# Altium project IRsensor_Relayx4_Controller.PrjPcb
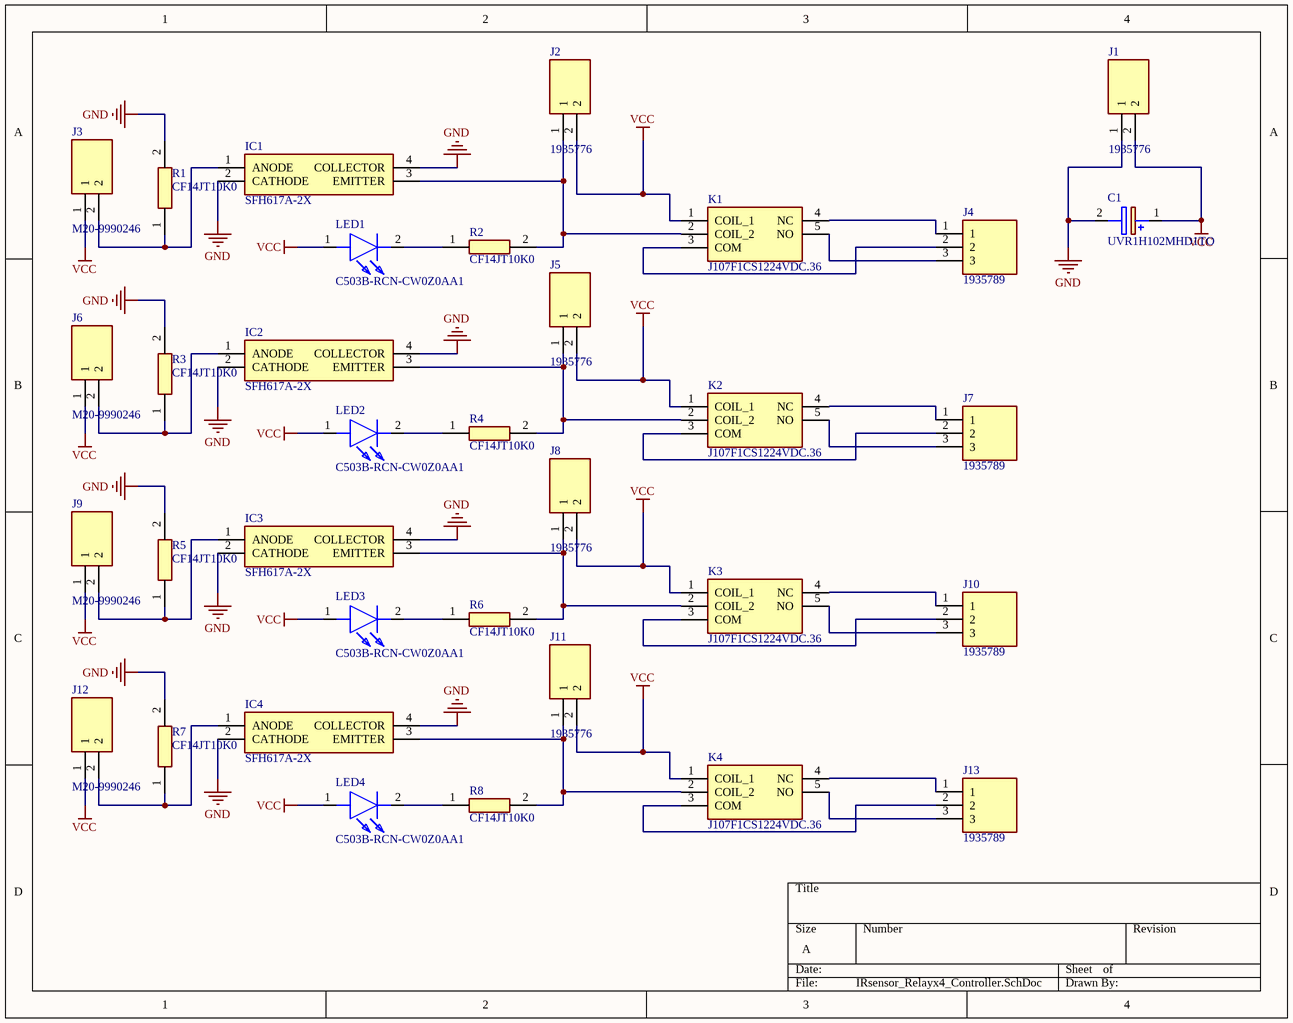
[diagram p0: IRsensor_Relayx4_Controller.SchDoc]
1 sheet, 34 parts. Net scope: global (net labels, ports and power ports of the same name join across sheets).
Board file: IRsensor_Relayx4_Controller.PcbDoc

## Sheet IRsensor_Relayx4_Controller.SchDoc
size A; SheetNumber: 1; SheetTotal: 1

### Parts
C1  UVR1H102MHD1TO  [CAPPRD500W60D1275H2700]
IC1  SFH617A-2X  [DIP762W50P254L458H400Q4N]
IC2  SFH617A-2X  [DIP762W50P254L458H400Q4N]
IC3  SFH617A-2X  [DIP762W50P254L458H400Q4N]
IC4  SFH617A-2X  [DIP762W50P254L458H400Q4N]
J1  1935776  [1935776]
J2  1935776  [1935776]
J3  M20-9990246  [HDRV2W66P0X254_1X2_508X254X874P]
J4  1935789  [1935789]
J5  1935776  [1935776]
J6  M20-9990246  [HDRV2W66P0X254_1X2_508X254X874P]
J7  1935789  [1935789]
J8  1935776  [1935776]
J9  M20-9990246  [HDRV2W66P0X254_1X2_508X254X874P]
J10  1935789  [1935789]
J11  1935776  [1935776]
J12  M20-9990246  [HDRV2W66P0X254_1X2_508X254X874P]
J13  1935789  [1935789]
K1  J107F1CS1224VDC.36  [J107F1CS1224VDC36]
K2  J107F1CS1224VDC.36  [J107F1CS1224VDC36]
K3  J107F1CS1224VDC.36  [J107F1CS1224VDC36]
K4  J107F1CS1224VDC.36  [J107F1CS1224VDC36]
LED1  C503B-RCN-CW0Z0AA1  [C503BRCNCW0Z0AA1]
LED2  C503B-RCN-CW0Z0AA1  [C503BRCNCW0Z0AA1]
LED3  C503B-RCN-CW0Z0AA1  [C503BRCNCW0Z0AA1]
LED4  C503B-RCN-CW0Z0AA1  [C503BRCNCW0Z0AA1]
R1  CF14JT10K0  [RESAD1520W63L600D230]
R2  CF14JT10K0  [RESAD1520W63L600D230]
R3  CF14JT10K0  [RESAD1520W63L600D230]
R4  CF14JT10K0  [RESAD1520W63L600D230]
R5  CF14JT10K0  [RESAD1520W63L600D230]
R6  CF14JT10K0  [RESAD1520W63L600D230]
R7  CF14JT10K0  [RESAD1520W63L600D230]
R8  CF14JT10K0  [RESAD1520W63L600D230]

### Nets
GND: C1.2(-) IC1.2(CATHODE) IC1.4(COLLECTOR) IC2.2(CATHODE) IC2.4(COLLECTOR) IC3.2(CATHODE) IC3.4(COLLECTOR) IC4.2(CATHODE) IC4.4(COLLECTOR) J1.1 R1.2 R3.2 R5.2 R7.2
VCC: C1.1(+) J1.2 J2.2 J3.1 J5.2 J6.1 J8.2 J9.1 J11.2 J12.1 K1.1(COIL_1) K2.1(COIL_1) K3.1(COIL_1) K4.1(COIL_1) LED1.1(A) LED2.1(A) LED3.1(A) LED4.1(A)
NetIC1_1: IC1.1(ANODE) J3.2 R1.1
NetIC1_3: IC1.3(EMITTER) J2.1 K1.2(COIL_2) R2.2
NetIC2_1: IC2.1(ANODE) J6.2 R3.1
NetIC2_3: IC2.3(EMITTER) J5.1 K2.2(COIL_2) R4.2
NetIC3_1: IC3.1(ANODE) J9.2 R5.1
NetIC3_3: IC3.3(EMITTER) J8.1 K3.2(COIL_2) R6.2
NetIC4_1: IC4.1(ANODE) J12.2 R7.1
NetIC4_3: IC4.3(EMITTER) J11.1 K4.2(COIL_2) R8.2
NetJ4_1: J4.1 K1.4(NC)
NetJ4_2: J4.2 K1.3(COM)
NetJ4_3: J4.3 K1.5(NO)
NetJ7_1: J7.1 K2.4(NC)
NetJ7_2: J7.2 K2.3(COM)
NetJ7_3: J7.3 K2.5(NO)
NetJ10_1: J10.1 K3.4(NC)
NetJ10_2: J10.2 K3.3(COM)
NetJ10_3: J10.3 K3.5(NO)
NetJ13_1: J13.1 K4.4(NC)
NetJ13_2: J13.2 K4.3(COM)
NetJ13_3: J13.3 K4.5(NO)
NetLED1_2: LED1.2(K) R2.1
NetLED2_2: LED2.2(K) R4.1
NetLED3_2: LED3.2(K) R6.1
NetLED4_2: LED4.2(K) R8.1

### Library data of the parts
C1 = UVR1H102MHD1TO: Capacitor Polarised; Manufacturer_Name: Nichicon; Datasheet Link: http://nichicon-us.com/english/products/pdfs/e-uvr.pdf; Height: 27mm; Manufacturer_Part_Number: UVR1H102MHD1TO; Mouser Part Number: 647-UVR1H102MHD1T0; Mouser Price/Stock: https://www.mouser.co.uk/ProductDetail/Nichicon/UVR1H102MHD1TO?qs=Wu4QelNNmeNg4t%252BBksLOmQ%3D%3D; Arrow Part Number: UVR1H102MHD1TO; Arrow Price/Stock: https://www.arrow.com/en/products/uvr1h102mhd1to/nichicon
IC1-IC4 = SFH617A-2X: Integrated Circuit; Manufacturer_Name: Isocom; Datasheet Link: http://www.farnell.com/datasheets/91023.pdf?_ga=2.50651689.1688980470.1514904698-1411154270.1472651675; Height: 4mm; Manufacturer_Part_Number: SFH617A-2X
J1 J2 J5 J8 J11 = 1935776: Connector; Manufacturer_Name: Phoenix Contact; Datasheet Link: https://datasheet.datasheetarchive.com/originals/distributors/Datasheets-DGA18/1075322.pdf; Height: 13.5mm; Manufacturer_Part_Number: 1935776; Mouser Part Number: 651-1935776; Mouser Price/Stock: https://www.mouser.co.uk/ProductDetail/Phoenix-Contact/1935776?qs=gjk32EaArKJ3oesOAo3TWA%3D%3D; Arrow Part Number: 1935776; Arrow Price/Stock: https://www.arrow.com/en/products/1935776/phoenix-contact?region=nac
J3 J6 J9 J12 = M20-9990246: Connector; Manufacturer_Name: Harwin; Datasheet Link: https://cdn.harwin.com/pdfs/M20-999.pdf; Height: 8.74mm; Manufacturer_Part_Number: M20-9990246; Mouser Part Number: 855-M20-9990246; Mouser Price/Stock: https://www.mouser.co.uk/ProductDetail/Harwin/M20-9990246?qs=Jph8NoUxIfWjw4WmyRvzag%3D%3D
J4 J7 J10 J13 = 1935789: Connector; Manufacturer_Name: Phoenix Contact; Datasheet Link: https://www.phoenixcontact.com/online/portal/us?uri=pxc-oc-itemdetail:pid=1935789&library=usen&tab=1; Height: 13.65mm; Manufacturer_Part_Number: 1935789; Mouser Part Number: 651-1935789; Mouser Price/Stock: https://www.mouser.co.uk/ProductDetail/Phoenix-Contact/1935789?qs=Acf35Ay%2FzLfkp38c%252B1VczQ%3D%3D; Arrow Part Number: 1935789; Arrow Price/Stock: https://www.arrow.com/en/products/1935789/phoenix-contact?region=nac
K1-K4 = J107F1CS1224VDC.36: Relay or Contactor; Manufacturer_Name: CIT; Datasheet Link: https://www.citrelay.com/Catalog%20Pages/RelayCatalog/J107F.pdf; Height: 15.29mm; Manufacturer_Part_Number: J107F1CS1224VDC.36
LED1-LED4 = C503B-RCN-CW0Z0AA1: LED; Manufacturer_Name: Cree; Datasheet Link: https://www.cree.com/led-components/media/documents/C503B-RAS-RAN-AAS-AAN-RBS-RBN-ABS-ABN-RCS-RCN-ACS-ACN-1079.pdf; Manufacturer_Part_Number: C503B-RCN-CW0Z0AA1; Mouser Part Number: 941-C503BRCNCW0Z0AA1; Mouser Price/Stock: https://www.mouser.com/Search/Refine.aspx?Keyword=941-C503BRCNCW0Z0AA1; Arrow Part Number: C503B-RCN-CW0Z0AA1; Arrow Price/Stock: https://www.arrow.com/en/products/c503b-rcn-cw0z0aa1/cree
R1-R8 = CF14JT10K0: Resistor; Manufacturer_Name: Stackpole Electronics Inc.; Datasheet Link: https://www.seielect.com/catalog/sei-cf_cfm.pdf; Manufacturer_Part_Number: CF14JT10K0; Arrow Part Number: CF14JT10K0; Arrow Price/Stock: https://www.arrow.com/en/products/cf14jt10k0/stackpole-electronics?region=nac